# Altium schematic sheet 2_Power.SchDoc
size A3; Organization: Altium Limited; Address1: L3, 12a Rodborough Rd; Address2: Frenchs Forest; Address3: NSW; Address4: Australia 2086
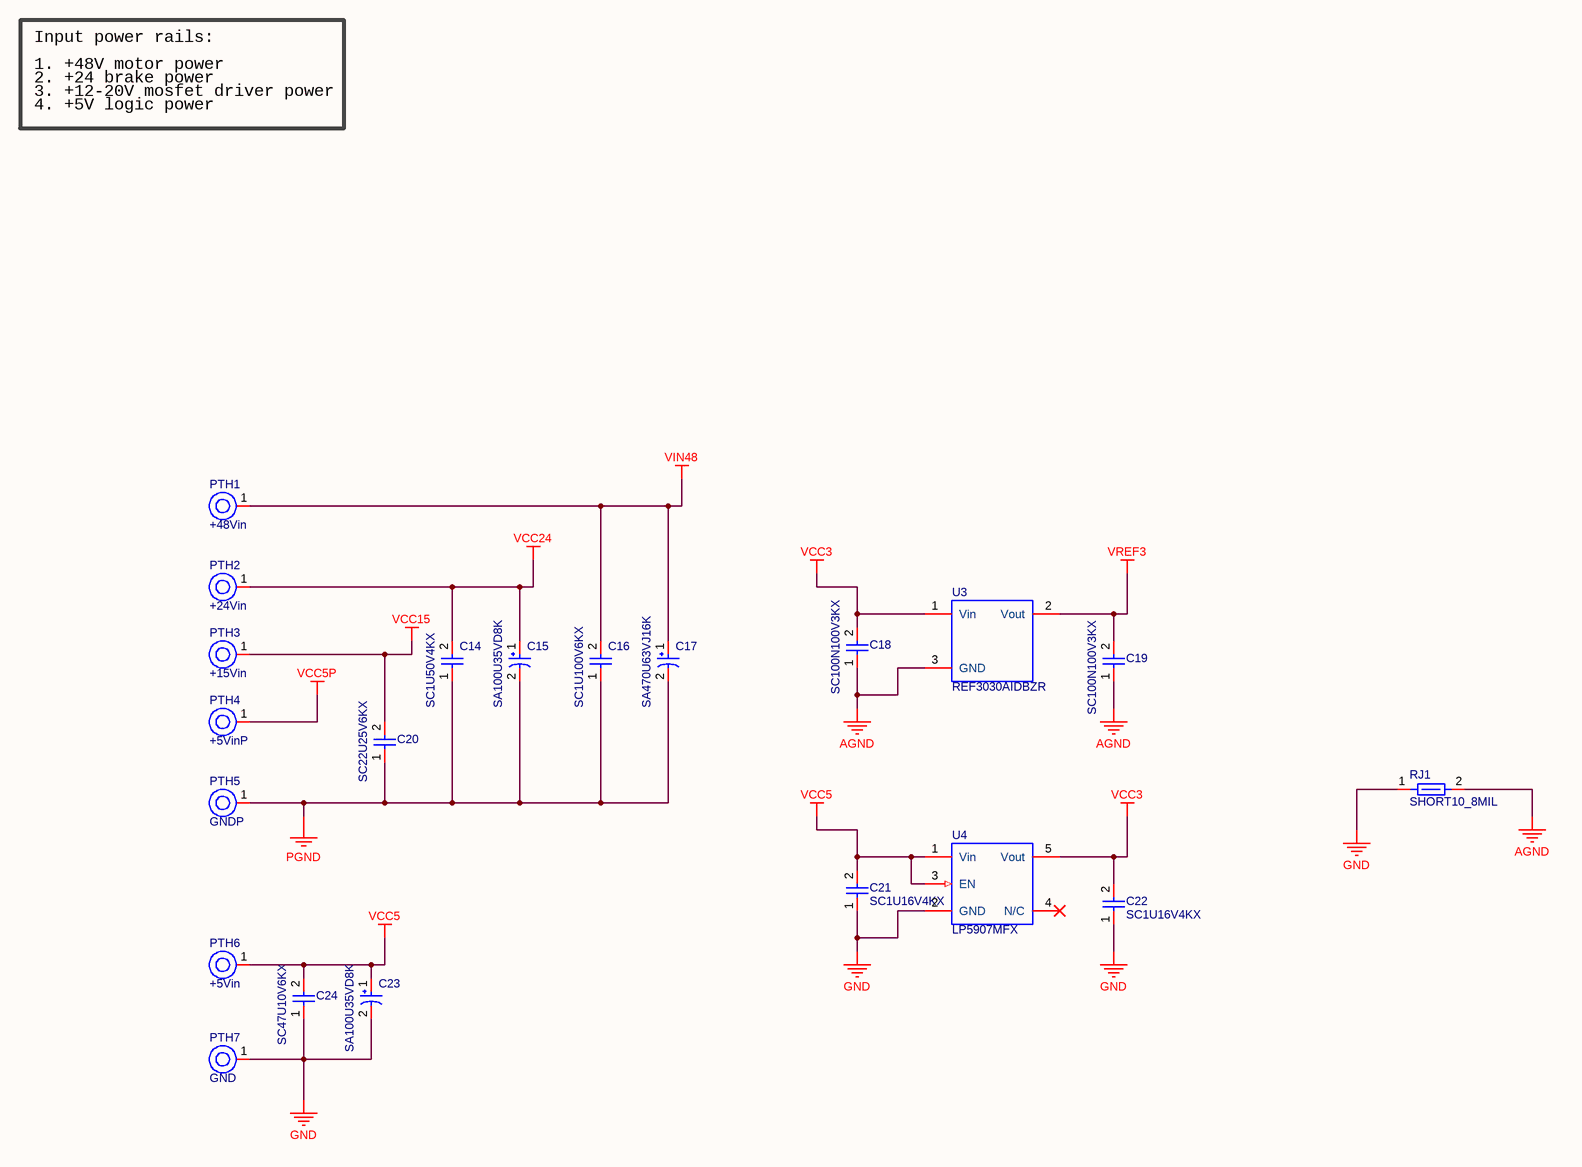
[diagram p0: 2_Power.SchDoc]

## Parts
C14  SC1U50V4KX  [CAPC0805(2012)145_L]
C15  SA100U35VD8K  [CAPAE(D8)7666X80L]
C16  SC1U100V6KX  [CAPC1206(3216)]
C17  SA470U63VJ16K  [CAPAE184170X170L]
C18  SC100N100V3KX  [CAPC0603(1608)100_L]
C19  SC100N100V3KX  [CAPC0603(1608)100_L]
C20  SC22U25V6KX  [CAPC1206(3216)]
C21  SC1U16V4KX  [CAPC0805(2012)145_L]
C22  SC1U16V4KX  [CAPC0805(2012)145_L]
C23  SA100U35VD8K  [CAPAE(D8)7666X80L]
C24  SC47U10V6KX  [CAPC1206(3216)]
PTH1  +48Vin  [POWERHOLE]  (no BOM)
PTH2  +24Vin  [POWERHOLE]  (no BOM)
PTH3  +15Vin  [POWERHOLE-LP]  (no BOM)
PTH4  +5VinP  [POWERHOLE-LP]  (no BOM)
PTH5  GNDP  [POWERHOLE]  (no BOM)
PTH6  +5Vin  [POWERHOLE-LP]  (no BOM)
PTH7  GND  [POWERHOLE-LP]  (no BOM)
RJ1  SHORT10_8MIL  [SHORT10_8MIL-FP]  (net tie, no BOM)
U3  REF3030AIDBZR  [SOT95P237X112-3L]
U4  LP5907MFX  [SOT95P280X145-5L]

## Nets
AGND: C18.1 C19.1 RJ1.2 U3.3(GND)
GND: C21.1 C22.1 C23.2 C24.1 PTH7.1(H1) RJ1.1 U4.2(GND)
PGND: C14.1 C15.2 C16.1 C17.2 C20.1 PTH5.1(H1)
VCC3: C18.2 C22.2 U3.1(Vin) U4.5(Vout)
VCC5: C21.2 C23.1 C24.2 PTH6.1(H1) U4.1(Vin) U4.3(EN)
VCC5P: PTH4.1(H1)
VCC15: C20.2 PTH3.1(H1)
VCC24: C14.2 C15.1 PTH2.1(H1)
VIN48: C16.2 C17.1 PTH1.1(H1)
VREF3: C19.2 U3.2(Vout)

Not connected (* = marked no-connect by the designer): U4 4(N/C)*

## Notes on the sheet
- Input power rails:
- 1. +48V motor power
- 2. +24 brake power
- 3. +12-20V mosfet driver power
- 4. +5V logic power
- Title
- Size:
- Date:
- A3
- Number:
- Time:
- Revision:
- Sheet
- of
- File:

## Library data of the parts
C14 = CAP(0805)1UF50V: CAP 1uF 50V ±10% 0805(1610 Metric) Thickness 1.2mm SMD
C15 C23 = CAP(D8)100UF35V: CAP 100uF 35V ±10% D8 Thickness 7.7mm SMD
C16 = CAP(1206)1UF100V: CAP 1uF 100V ±10% 1206(3216 Metric) Thickness 1.8mm SMD
C17 = CAP(J16)470UF63V: EEVFK1J471M CAP 470uF 63V ±10% J16 Thickness 17mm SMD
C18 C19 = CAP(0603)100nF100V: CAP 100nF 100V ±10% 0603(1608 Metric) Thickness 1mm SMD
C20 = CAP(1206)22UF25V: CAP 22uF 25V ±10% 1206(3216 Metric) Thickness 1.8mm SMD
C21 C22 = CAP(0805)1UF16V: CAP 1uF 16V ±10% 0805(1610 Metric) Thickness 0.6mm SMD
C24 = CAP(1206)47UF10V: CAP 47uF 10V ±10% 1206(3216 Metric) Thickness 1.6mm SMD
PTH1 PTH2 PTH5 = PTH-2M: 2mm hole 3.5mm pad; Pad diameter (mm): 5; Hole diameter (mm): 2.5
PTH3 PTH4 PTH6 PTH7 = PTH-1D2M: 1.2mm hole 2mm pad; Pad diameter (mm): 5; Hole diameter (mm): 2.5
RJ1 = SHORT*: Net tie (10x8mil); Resistance: 0; Tolerance: 5%; Value: 0; Pins: 2; Case/Package: 10x8mil; Mounting Technology: SMT
U3 = REF-REF3030: 3V 25mA 0.2%
U4 = LP5907V3.3: 3.3V 250mA